# EAGLE board Full (EAGLE 9.6.2), part 1 of 3
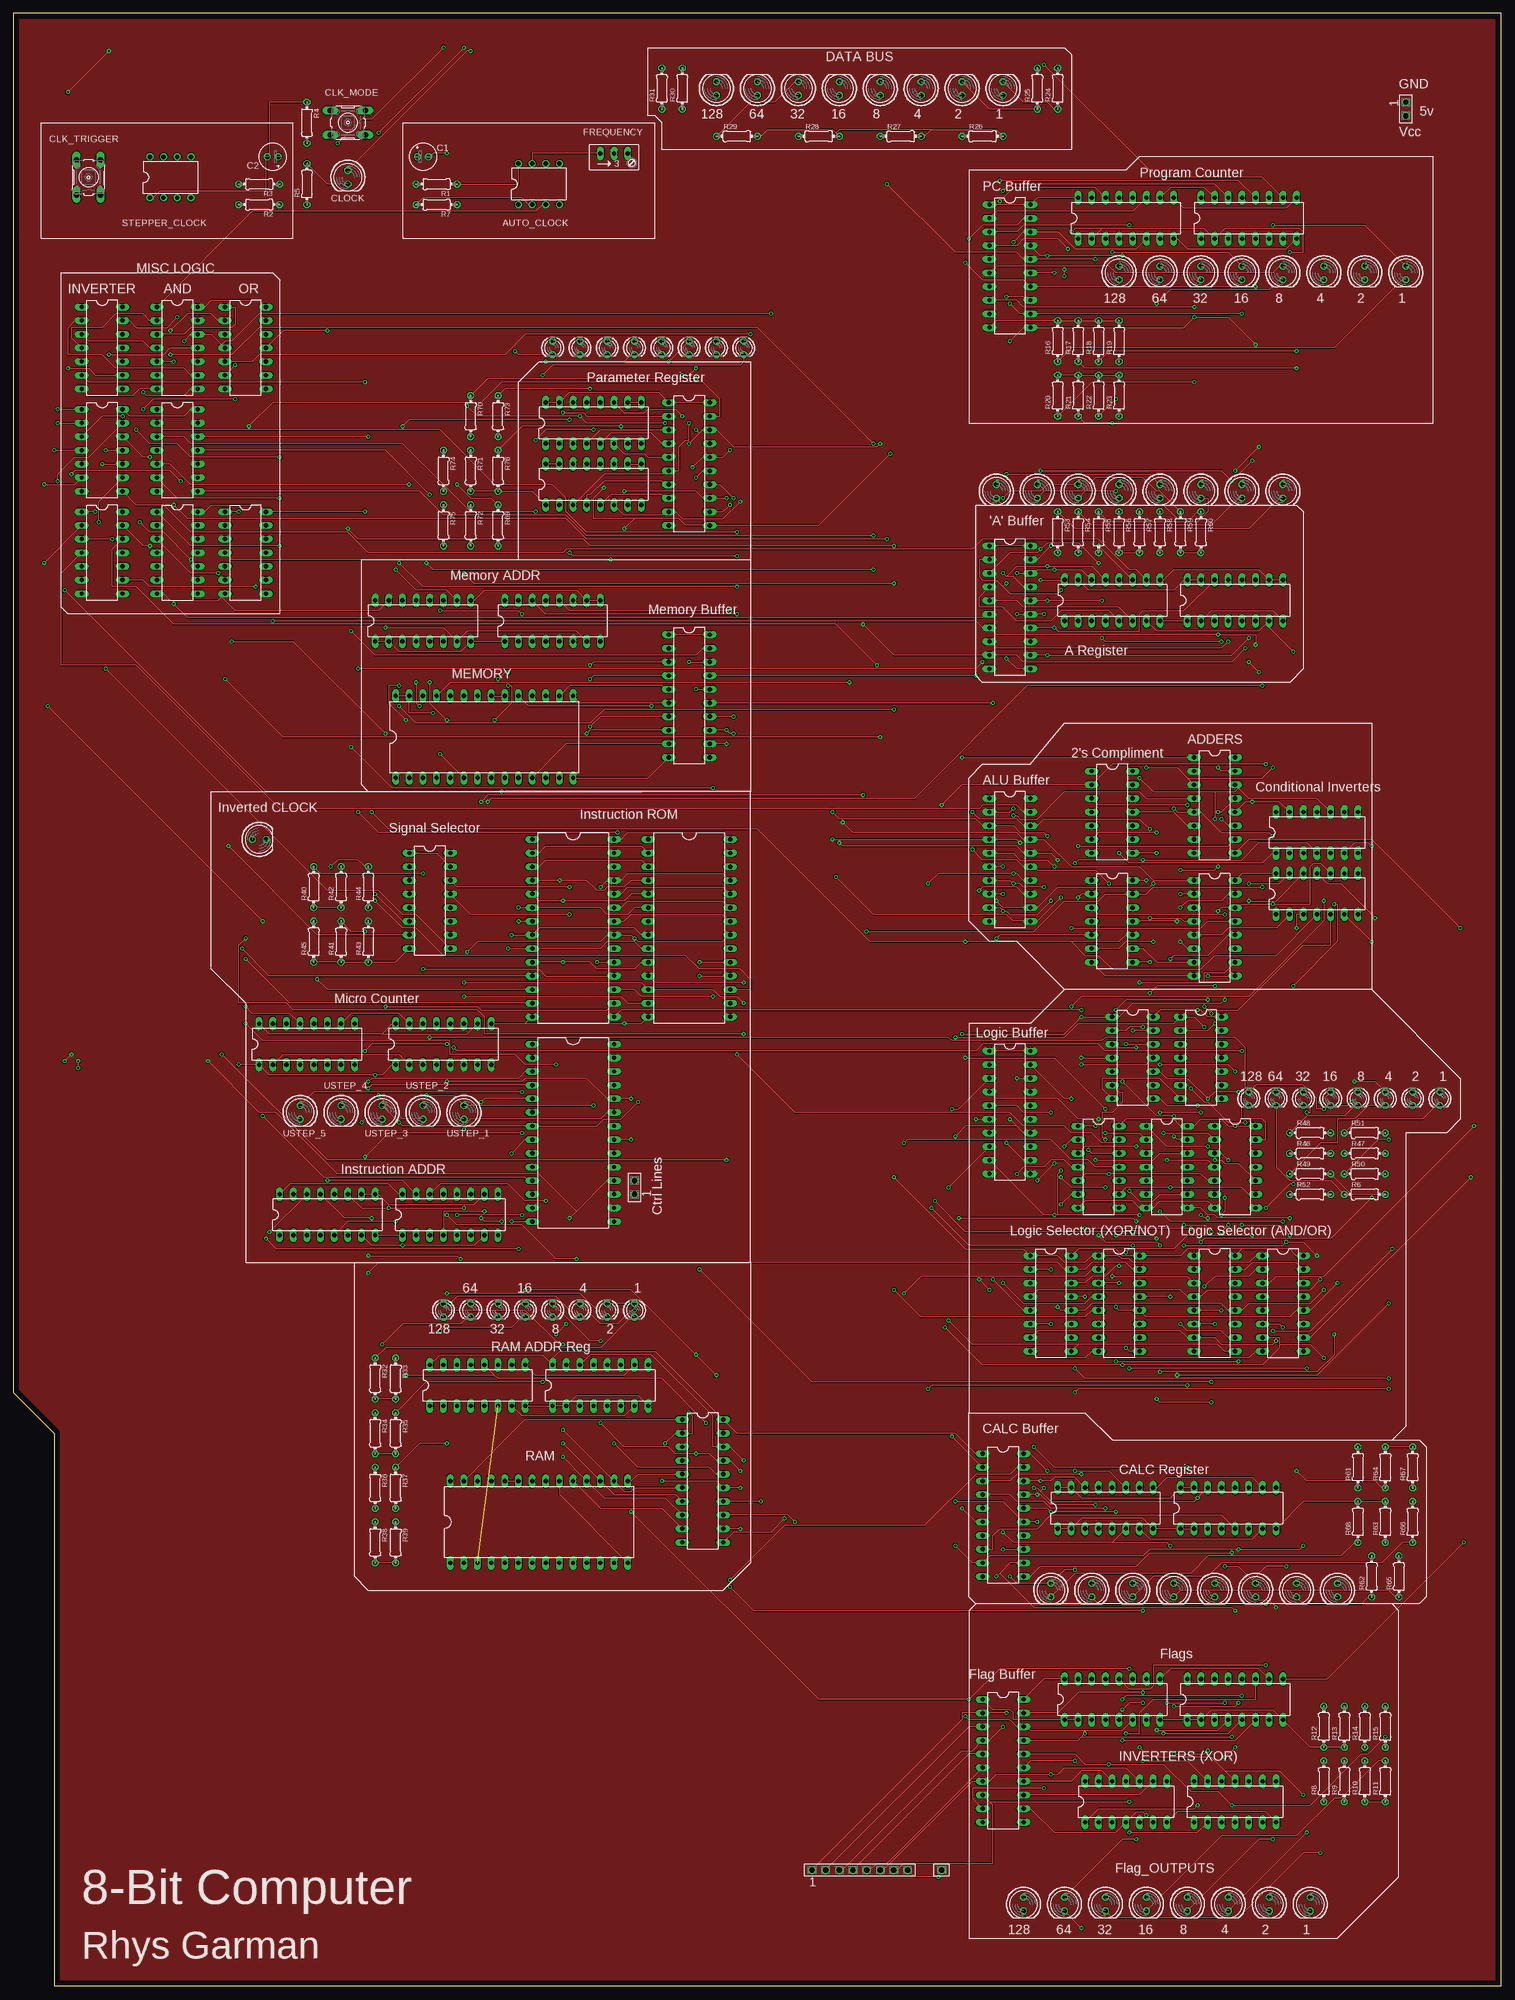
[diagram p5: board, top side]
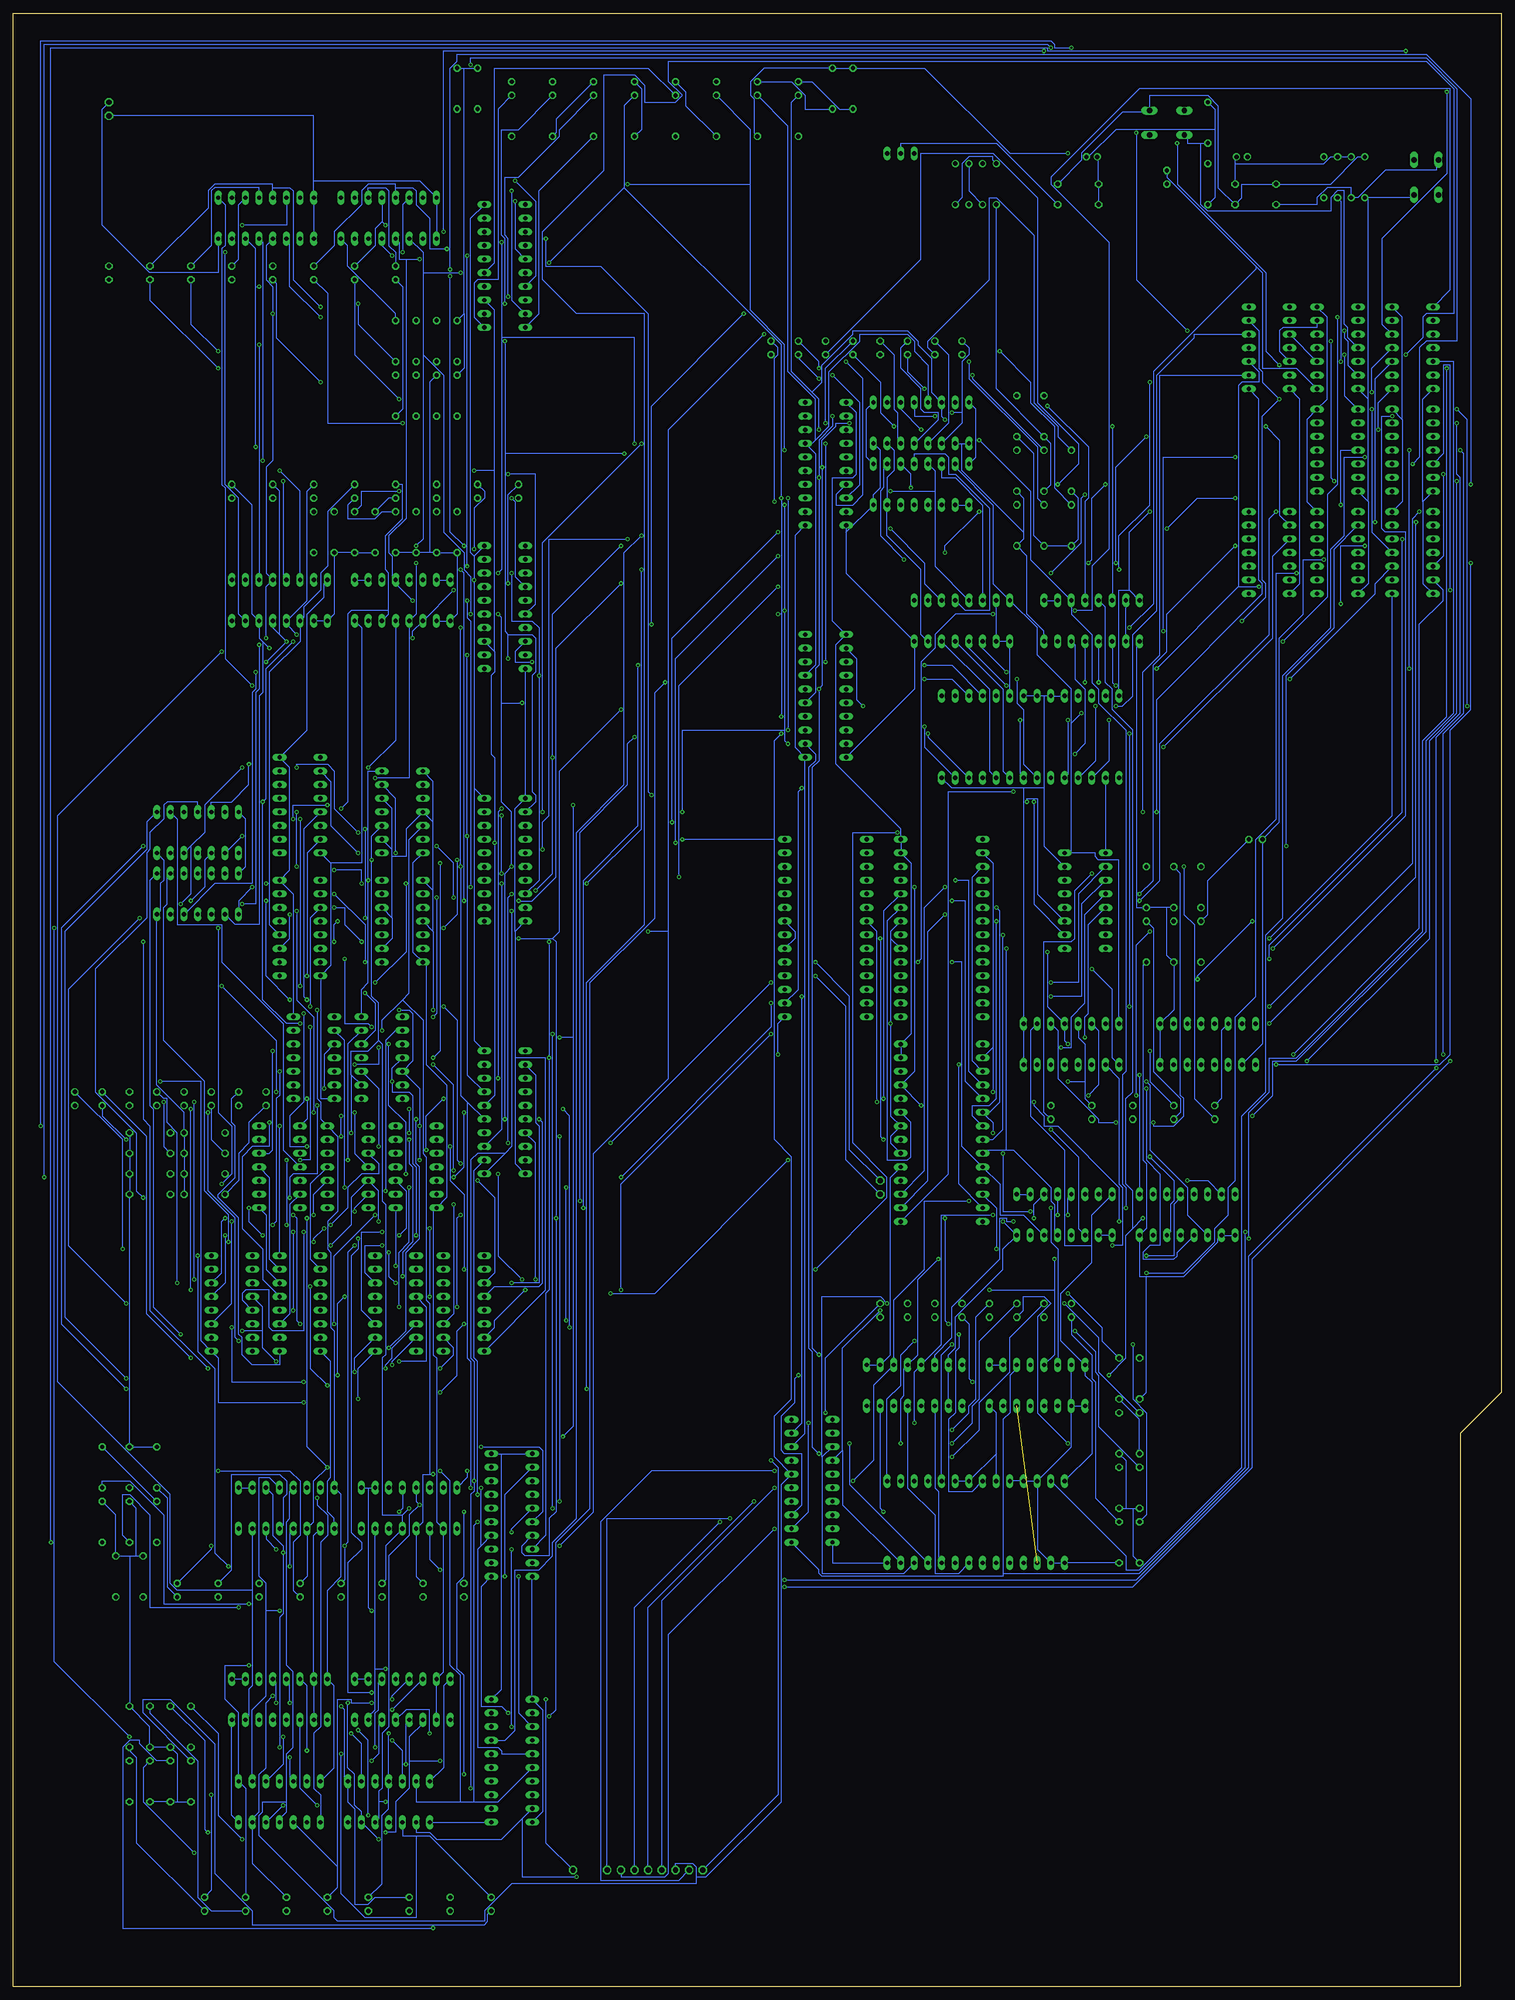
[diagram p6: board, bottom side, seen from below]

Size 276.86 x 367.03 mm. Coordinates in mm from the lower left corner, seen from the top.
Outline: 276.86,367.03 0,367.03 0,110.49 7.62,102.87 7.62,0 276.86,0 276.86,367.03
Copper layers (1*16): Top 0.035mm / dielectric 1.5mm / Bottom 0.035mm
Design rules "default": minimum track width 6mil, minimum drill 0.35mm, track to track 6mil, track to pad 6mil, pad to pad 6mil, via to via 6mil, smd to smd 6mil, copper to edge 40mil, drill to drill 6mil, minimum pad ring 10mil, minimum via ring 8mil, stop-mask expansion 4mil, vias tented up to drill 0mil, thermal gap 10mil

## Footprints (pad centres in the part's own frame; a part is rotated, then mirrored left to right if it is on the bottom)
DIL16 = drill 0.813 long: 1 -8.89,-3.81; 2 -6.35,-3.81; 3 -3.81,-3.81; 4 -1.27,-3.81; 5 1.27,-3.81; 6 3.81,-3.81; 7 6.35,-3.81; 8 8.89,-3.81; 9 8.89,3.81; 10 6.35,3.81; 11 3.81,3.81; 12 1.27,3.81; 13 -1.27,3.81; 14 -3.81,3.81; 15 -6.35,3.81; 16 -8.89,3.81
SSW-102-02-G-S = drill 1 pad 1.5 octagon: 1 -1.27,0; 2 1.27,0
DIL14 = drill 0.813 long: 1 -7.62,-3.81; 2 -5.08,-3.81; 3 -2.54,-3.81; 4 0,-3.81; 5 2.54,-3.81; 6 5.08,-3.81; 7 7.62,-3.81; 8 7.62,3.81; 9 5.08,3.81; 10 2.54,3.81; 11 0,3.81; 12 -2.54,3.81; 13 -5.08,3.81; 14 -7.62,3.81
DIL08 = drill 0.813 pad 1.27: 1 -3.81,-3.81; 2 -1.27,-3.81; 3 1.27,-3.81; 4 3.81,-3.81; 5 3.81,3.81; 6 1.27,3.81; 7 -1.27,3.81; 8 -3.81,3.81
E2-5 = drill 0.813 pad 1.27: + -1.016,0 | drill 0.813 pad 1.27 octagon: - 1.016,0
SSW-101-02-G-S = drill 1 pad 1.5 octagon: 1 0,0
B3F-10XX = drill 1.016 long: 1 -3.251,2.261; 2 3.251,2.261; 3 -3.251,-2.261; 4 3.251,-2.261
LED5MM = drill 0.813 octagon: A -1.27,0; K 1.27,0
SSW-108-02-G-S = drill 1 pad 1.5 octagon: 1 -8.89,0; 2 -6.35,0; 3 -3.81,0; 4 -1.27,0; 5 1.27,0; 6 3.81,0; 7 6.35,0; 8 8.89,0
RJ9W = drill 0.813 long: A 2.54,0.635; E -2.54,0.635; S 0,0.635
DIL28-6 = drill 0.813 long: 1 -16.51,-7.62; 2 -13.97,-7.62; 3 -11.43,-7.62; 4 -8.89,-7.62; 5 -6.35,-7.62; 6 -3.81,-7.62; 7 -1.27,-7.62; 8 1.27,-7.62; 9 3.81,-7.62; 10 6.35,-7.62; 11 8.89,-7.62; 12 11.43,-7.62; 13 13.97,-7.62; 14 16.51,-7.62; 15 16.51,7.62; 16 13.97,7.62; 17 11.43,7.62; 18 8.89,7.62; 19 6.35,7.62; 20 3.81,7.62; 21 1.27,7.62; 22 -1.27,7.62; 23 -3.81,7.62; 24 -6.35,7.62; 25 -8.89,7.62; 26 -11.43,7.62; 27 -13.97,7.62; 28 -16.51,7.62
LED3MM = drill 0.813 octagon: A -1.27,0; K 1.27,0
DIL20 = drill 0.813 long: 1 -11.43,-3.81; 2 -8.89,-3.81; 3 -6.35,-3.81; 4 -3.81,-3.81; 5 -1.27,-3.81; 6 1.27,-3.81; 7 3.81,-3.81; 8 6.35,-3.81; 9 8.89,-3.81; 10 11.43,-3.81; 11 11.43,3.81; 12 8.89,3.81; 13 6.35,3.81; 14 3.81,3.81; 15 1.27,3.81; 16 -1.27,3.81; 17 -3.81,3.81; 18 -6.35,3.81; 19 -8.89,3.81; 20 -11.43,3.81
0204/7 = drill 0.813 octagon: 1 -3.81,0; 2 3.81,0

## Placement (x,y rotation side)
ADDER_LOWER  74LS283N  [DIL16]  223.52,196.85 270 top
ADDER_UPPER  74LS283N  [DIL16]  223.52,219.71 270 top
ADDITIONAL_CONTROL_LINES  SSW-102-02-G-S  [SSW-102-02-G-S]  115.57,148.59 90 top
ADDR_MEM_REG_LOWER  74LS173N  [DIL16]  100.33,254 0 top
ADDR_MEM_REG_UPPER  74LS173N  [DIL16]  76.2,254 0 top
ADDR_REG_A_LOWER  74LS173N  [DIL16]  227.33,257.81 0 top
ADDR_REG_A_UPPER  74LS173N  [DIL16]  204.47,257.81 0 top
ADDR_REG_CALC_LOWER  74LS173N  [DIL16]  226.06,88.9 0 top
ADDR_REG_CALC_LOWER1  74LS173N  [DIL16]  107.95,279.4 0 top
ADDR_REG_CALC_UPPER  74LS173N  [DIL16]  203.2,88.9 0 top
ADDR_REG_PARAM_UPPER  74LS173N  [DIL16]  107.95,290.83 0 top
AND_GATE1  74LS30N  [DIL14]  30.48,285.75 270 top
AND_GATE1_  74LS08N  [DIL14]  214.63,152.4 270 top
AND_GATE2_  74LS08N  [DIL14]  227.33,152.4 270 top
AND_GATE3_  74LS08N  [DIL14]  30.48,266.7 270 top
AND_GATE_  74LS08N  [DIL14]  30.48,304.8 270 top
AUTO_CLOCK  NE555N  [DIL08]  97.79,335.28 0 top
C1  4.7uF  [E2-5]  76.2,340.36 0 top
C2  0.1uF  [E2-5]  48.26,340.36 180 top
CLK_EXTENSION  SSW-101-02-G-S  [SSW-101-02-G-S]  172.72,21.59 0 top
CLK_MODE  [B3F-10XX]  62.23,346.71 180 top
CLK_TRIGGER  [B3F-10XX]  13.97,336.55 90 top
CLOCK  [LED5MM]  62.23,336.55 270 top
DATA_BUS_EXTENSION  SSW-108-02-G-S  [SSW-108-02-G-S]  157.48,21.59 0 top
DATABUS_1  [LED5MM]  184.15,353.06 90 top
DATABUS_2  [LED5MM]  176.53,353.06 90 top
DATABUS_3  [LED5MM]  168.91,353.06 90 top
DATABUS_4  [LED5MM]  161.29,353.06 90 top
DATABUS_5  [LED5MM]  153.67,353.06 90 top
DATABUS_6  [LED5MM]  146.05,353.06 90 top
DATABUS_7  [LED5MM]  138.43,353.06 90 top
DATABUS_8  [LED5MM]  130.81,353.06 90 top
FLAG_1  [LED5MM]  241.3,15.24 270 top
FLAG_2  [LED5MM]  233.68,15.24 270 top
FLAG_3  [LED5MM]  226.06,15.24 270 top
FLAG_4  [LED5MM]  218.44,15.24 270 top
FLAG_5  [LED5MM]  210.82,15.24 270 top
FLAG_6  [LED5MM]  203.2,15.24 270 top
FLAG_7  [LED5MM]  195.58,15.24 270 top
FLAG_8  [LED5MM]  187.96,15.24 270 top
FLAG_REG_LOWER  74LS173N  [DIL16]  227.33,53.34 0 top
FLAG_REG_UPPER  74LS173N  [DIL16]  204.47,53.34 0 top
FREQUENCY  100k  [RJ9W]  111.76,340.36 0 top
INSTRUC_REGISTER_LOWER  74LS173N  [DIL16]  81.28,143.51 0 top
INSTRUC_REGISTER_UPPER  74LS173N  [DIL16]  58.42,143.51 0 top
INSTRUCTION_MEMORY_LOWER  AT28C64B  [DIL28-6]  104.14,158.75 270 top
INSTRUCTION_MEMORY_UPPER  AT28C64B  [DIL28-6]  104.14,196.85 270 top
INSTRUCTION_MEMORY_UPPER2  AT28C64B  [DIL28-6]  125.73,196.85 270 top
INVERTED_CLK_LED  [LED5MM]  45.72,213.36 0 top
LED_A_REG_1  [LED5MM]  236.22,278.13 270 top
LED_A_REG_2  [LED5MM]  228.6,278.13 270 top
LED_A_REG_3  [LED5MM]  220.98,278.13 270 top
LED_A_REG_4  [LED5MM]  213.36,278.13 270 top
LED_A_REG_5  [LED5MM]  205.74,278.13 270 top
LED_A_REG_6  [LED5MM]  198.12,278.13 270 top
LED_A_REG_7  [LED5MM]  190.5,278.13 270 top
LED_A_REG_8  [LED5MM]  182.88,278.13 270 top
LED_B_REG_1  [LED5MM]  246.38,73.66 270 top
LED_B_REG_2  [LED5MM]  238.76,73.66 270 top
LED_B_REG_3  [LED5MM]  231.14,73.66 270 top
LED_B_REG_4  [LED5MM]  223.52,73.66 270 top
LED_B_REG_5  [LED5MM]  215.9,73.66 270 top
LED_B_REG_6  [LED5MM]  208.28,73.66 270 top
LED_B_REG_7  [LED5MM]  200.66,73.66 270 top
LED_B_REG_8  [LED5MM]  193.04,73.66 270 top
LOGIC_LED_1  [LED3MM]  265.43,165.1 270 top
LOGIC_LED_2  [LED3MM]  260.35,165.1 270 top
LOGIC_LED_3  [LED3MM]  255.27,165.1 270 top
LOGIC_LED_4  [LED3MM]  250.19,165.1 270 top
LOGIC_LED_5  [LED3MM]  245.11,165.1 270 top
LOGIC_LED_6  [LED3MM]  240.03,165.1 270 top
LOGIC_LED_7  [LED3MM]  234.95,165.1 270 top
LOGIC_LED_8  [LED3MM]  229.87,165.1 270 top
LOGIC_SELECTOR-AND/OR_LOWER  74LS157N  [DIL16]  236.22,127 270 top
LOGIC_SELECTOR-AND/OR_UPPER  74LS157N  [DIL16]  223.52,127 270 top
LOGIC_SELECTOR-XOR/NOT_LOWER  74LS157N  [DIL16]  205.74,127 270 top
LOGIC_SELECTOR-XOR/NOT_UPPER  74LS157N  [DIL16]  193.04,127 270 top
MEMORY  AT28C64B  [DIL28-6]  87.63,232.41 0 top
MICRO_COUNTER_LOWER  74LS161  [DIL16]  80.01,175.26 0 top
MICRO_COUNTER_UPPER  74LS161  [DIL16]  54.61,175.26 0 top
NOT_GATE  74LS04N  [DIL14]  201.93,152.4 270 top
NOT_GATE1  74LS04N  [DIL14]  16.51,304.8 270 top
NOT_GATE2_  74LS04N  [DIL14]  16.51,285.75 270 top
NOT_GATE2_1  74LS04N  [DIL14]  43.18,266.7 270 top
NOT_GATE3_  74LS04N  [DIL14]  16.51,266.7 270 top
OR_GATE  74LS32N  [DIL14]  208.28,172.72 270 top
OR_GATE1  74LS32N  [DIL14]  43.18,304.8 270 top
OR_GATE_2  74LS32N  [DIL14]  220.98,172.72 270 top
OUTPUT_BUFFER_ALU  74LS245N  [DIL20]  185.42,209.55 270 top
OUTPUT_BUFFER_CALC_REG  74LS245N  [DIL20]  184.15,87.63 270 top
OUTPUT_BUFFER_FLAGS  74HC245N  [DIL20]  184.15,41.91 270 top
OUTPUT_BUFFER_LOGIC  74LS245N  [DIL20]  185.42,162.56 270 top
OUTPUT_BUFFER_MEMORY  74LS245N  [DIL20]  125.73,240.03 270 top
OUTPUT_BUFFER_PARAM_REG  74LS245N  [DIL20]  125.73,283.21 270 top
OUTPUT_BUFFER_PC  74LS245N  [DIL20]  185.42,320.04 270 top
OUTPUT_BUFFER_RAM  74HC245N  [DIL20]  128.27,93.98 270 top
OUTPUT_BUFFER_REG_A  74LS245N  [DIL20]  185.42,256.54 270 top
PARAM_LED_1  [LED3MM]  135.89,304.8 270 top
PARAM_LED_2  [LED3MM]  130.81,304.8 270 top
PARAM_LED_3  [LED3MM]  125.73,304.8 270 top
PARAM_LED_4  [LED3MM]  120.65,304.8 270 top
PARAM_LED_5  [LED3MM]  115.57,304.8 270 top
PARAM_LED_6  [LED3MM]  110.49,304.8 270 top
PARAM_LED_7  [LED3MM]  105.41,304.8 270 top
PARAM_LED_8  [LED3MM]  100.33,304.8 270 top
PC_1  [LED5MM]  259.08,318.77 270 top
PC_2  [LED5MM]  251.46,318.77 270 top
PC_3  [LED5MM]  243.84,318.77 270 top
PC_4  [LED5MM]  236.22,318.77 270 top
PC_5  [LED5MM]  228.6,318.77 270 top
PC_6  [LED5MM]  220.98,318.77 270 top
PC_7  [LED5MM]  213.36,318.77 270 top
PC_8  [LED5MM]  205.74,318.77 270 top
POWER  SSW-102-02-G-S  [SSW-102-02-G-S]  259.08,349.25 270 top
PROGRAM_COUNTER_LOWER  74LS161  [DIL16]  229.87,328.93 0 top
PROGRAM_COUNTER_UPPER  74LS161  [DIL16]  207.01,328.93 0 top
R1  1k  [0204/7]  78.74,335.28 180 top
R2  1k  [0204/7]  45.72,331.47 180 top
R3  10k  [0204/7]  45.72,335.28 180 top
R4  220  [0204/7]  54.61,346.71 270 top
R5  ~220  [0204/7]  54.61,335.28 90 top
R6  ~220  [0204/7]  251.46,147.32 0 top
R7  220  [0204/7]  78.74,331.47 180 top
R8  ~220  [0204/7]  243.84,38.1 90 top
R9  ~220  [0204/7]  247.65,38.1 90 top
R10  ~220  [0204/7]  251.46,38.1 90 top
R11  ~220  [0204/7]  255.27,38.1 90 top
R12  ~220  [0204/7]  243.84,48.26 90 top
R13  ~220  [0204/7]  247.65,48.26 90 top
R14  ~220  [0204/7]  251.46,48.26 90 top
R15  ~220  [0204/7]  255.27,48.26 90 top
R16  ~220  [0204/7]  194.31,306.07 90 top
R17  ~220  [0204/7]  198.12,306.07 90 top
R18  ~220  [0204/7]  201.93,306.07 90 top
R19  ~220  [0204/7]  205.74,306.07 90 top
R20  ~220  [0204/7]  194.31,295.91 90 top
R21  ~220  [0204/7]  198.12,295.91 90 top
R22  ~220  [0204/7]  201.93,295.91 90 top
R23  ~220  [0204/7]  205.74,295.91 90 top
R24  ~220  [0204/7]  194.31,353.06 90 top
R25  ~220  [0204/7]  190.5,353.06 90 top
R26  ~220  [0204/7]  180.34,344.17 0 top
R27  ~220  [0204/7]  165.1,344.17 0 top
R28  ~220  [0204/7]  149.86,344.17 0 top
R29  ~220  [0204/7]  134.62,344.17 0 top
R30  ~220  [0204/7]  124.46,353.06 90 top
R31  ~220  [0204/7]  120.65,353.06 90 top
R32  ~220  [0204/7]  67.31,113.03 270 top
R33  ~220  [0204/7]  71.12,113.03 270 top
R34  ~220  [0204/7]  67.31,102.87 270 top
R35  ~220  [0204/7]  71.12,102.87 270 top
R36  ~220  [0204/7]  67.31,92.71 270 top
R37  ~220  [0204/7]  71.12,92.71 270 top
R38  ~220  [0204/7]  67.31,82.55 270 top
R39  ~220  [0204/7]  71.12,82.55 270 top
R40  ~220  [0204/7]  55.88,204.47 90 top
R41  ~220  [0204/7]  60.96,194.31 90 top
R42  ~220  [0204/7]  60.96,204.47 90 top
R43  ~220  [0204/7]  66.04,194.31 90 top
R44  ~220  [0204/7]  66.04,204.47 90 top
R45  ~220  [0204/7]  55.88,194.31 90 top
R46  ~220  [0204/7]  241.3,154.94 0 top
R47  ~220  [0204/7]  251.46,154.94 0 top
R48  ~220  [0204/7]  241.3,158.75 0 top
R49  ~220  [0204/7]  241.3,151.13 0 top
R50  ~220  [0204/7]  251.46,151.13 0 top
R51  ~220  [0204/7]  251.46,158.75 0 top
R52  ~220  [0204/7]  241.3,147.32 0 top
R53  ~220  [0204/7]  194.31,270.51 270 top
R54  ~220  [0204/7]  198.12,270.51 270 top
R55  ~220  [0204/7]  201.93,270.51 270 top
R56  ~220  [0204/7]  205.74,270.51 270 top
R57  ~220  [0204/7]  209.55,270.51 270 top
R58  ~220  [0204/7]  213.36,270.51 270 top
R59  ~220  [0204/7]  217.17,270.51 270 top
R60  ~220  [0204/7]  220.98,270.51 270 top
R61  ~220  [0204/7]  250.19,96.52 90 top
R62  ~220  [0204/7]  252.73,76.2 90 top
R63  ~220  [0204/7]  255.27,86.36 90 top
R64  ~220  [0204/7]  255.27,96.52 90 top
R65  ~220  [0204/7]  257.81,76.2 90 top
R66  ~220  [0204/7]  260.35,86.36 90 top
R67  ~220  [0204/7]  260.35,96.52 90 top
R68  ~220  [0204/7]  250.19,86.36 90 top
R69  ~220  [0204/7]  90.17,271.78 270 top
R70  ~220  [0204/7]  85.09,292.1 270 top
R71  ~220  [0204/7]  85.09,281.94 270 top
R72  ~220  [0204/7]  85.09,271.78 270 top
R73  ~220  [0204/7]  90.17,292.1 270 top
R74  ~220  [0204/7]  80.01,281.94 270 top
R75  ~220  [0204/7]  80.01,271.78 270 top
R76  ~220  [0204/7]  90.17,281.94 270 top
RAM  71256SA15TPG  [DIL28-6]  97.79,86.36 0 top
RAM_ADDR_LOWER  74LS173N  [DIL16]  109.22,111.76 0 top
RAM_ADDR_UPPER  74LS173N  [DIL16]  86.36,111.76 0 top
RAM_LED_1  [LED3MM]  115.57,125.73 270 top
RAM_LED_2  [LED3MM]  110.49,125.73 270 top
RAM_LED_3  [LED3MM]  105.41,125.73 270 top
RAM_LED_4  [LED3MM]  100.33,125.73 270 top
RAM_LED_5  [LED3MM]  95.25,125.73 270 top
RAM_LED_6  [LED3MM]  90.17,125.73 270 top
RAM_LED_7  [LED3MM]  85.09,125.73 270 top
RAM_LED_8  [LED3MM]  80.01,125.73 270 top
SELECTOR_  74HC139N  [DIL16]  77.47,201.93 270 top
STEPPER_CLOCK  NE555N  [DIL08]  29.21,336.55 0 top
SUBTRACT_INVRTR_LOWER_  74LS86N  [DIL14]  204.47,198.12 270 top
SUBTRACT_INVRTR_LOWER_1  74LS86N  [DIL14]  242.57,214.63 0 top
SUBTRACT_INVRTR_UPPER_  74LS86N  [DIL14]  204.47,218.44 270 top
SUBTRACT_INVRTR_UPPER_1  74LS86N  [DIL14]  242.57,203.2 0 top
USTEP_1  [LED5MM]  83.82,162.56 270 top
USTEP_2  [LED5MM]  76.2,162.56 270 top
USTEP_3  [LED5MM]  68.58,162.56 270 top
USTEP_4  [LED5MM]  60.96,162.56 270 top
USTEP_5  [LED5MM]  53.34,162.56 270 top
XOR_GATE2_  74LS86N  [DIL14]  227.33,34.29 0 top
XOR_GATE_  74LS86N  [DIL14]  207.01,34.29 0 top

## Tracks (layer width: path | path; a pad name or v marks a point on that pad's centre or on a via)
1_PLACE  (via drill 0.35)
  Top 0.152: v184.79,247.01 186.69,245.11 OUTPUT_BUFFER_REG_A.11 | v186.69,168.91 OUTPUT_BUFFER_LOGIC.18 | v186.06,219.07 185.42,218.44 OUTPUT_BUFFER_ALU.2 | v231.14,305.44 226.06,310.51 v219.71,310.51 217.81,308.61 OUTPUT_BUFFER_PC.11 187.96,308.61 v185.42,306.07 | v227.33,44.45 v225.43,42.54 | v184.79,50.8 OUTPUT_BUFFER_FLAGS.2 176.53,50.8 176.53,49.53 DATA_BUS_EXTENSION.1 | v226.69,80.64 211.46,80.64 208.91,78.1 191.13,78.1 189.23,76.2 OUTPUT_BUFFER_CALC_REG.11 | 115.57,273.05 v113.67,271.14 | 115.57,273.05 123.83,273.05 125.09,271.78 OUTPUT_BUFFER_PARAM_REG.11 149.86,271.78 v163.19,285.12 | v109.86,278.76 107.95,276.86 107.95,273.05 115.57,273.05 | RAM_ADDR_LOWER.14 107.31,117.47 118.75,117.47 130.18,106.04 130.18,100.33 OUTPUT_BUFFER_RAM.18 133.35,100.33 v135.89,97.79 | v87,142.88 87.63,142.24 v90.81,142.24
  Bottom 0.152: OUTPUT_BUFFER_ALU.2 179.7,220.34 179.7,221.61 180.34,222.25 180.34,243.84 179.7,244.47 179.7,250.82 180.34,251.46 184.79,251.46 | v184.79,247.01 184.79,251.46 | v186.69,168.91 186.69,218.44 v186.06,219.07 | OUTPUT_BUFFER_PC.11 191.13,310.51 191.13,316.87 190.5,317.5 186.69,317.5 186.69,349.25 DATABUS_1.A | PROGRAM_COUNTER_LOWER.3 225.43,324.49 225.43,316.23 v219.71,310.51 | v231.14,305.44 ADDR_REG_A_LOWER.11 | 184.79,251.46 185.42,252.09 185.42,285.12 | v185.42,306.07 185.42,285.12 | XOR_GATE2_.12 225.43,38.73 v225.43,42.54 | v227.33,44.45 227.33,68.58 226.69,69.22 v226.69,80.64 226.69,81.91 228.6,83.82 228.6,91.44 ADDR_REG_CALC_LOWER.11 | v184.79,50.8 186.06,52.07 189.87,52.07 189.87,74.29 OUTPUT_BUFFER_CALC_REG.11 | OUTPUT_BUFFER_PARAM_REG.11 131.44,269.88 131.44,230.5 OUTPUT_BUFFER_MEMORY.11 129.54,102.87 OUTPUT_BUFFER_RAM.18 | ADDR_MEM_REG_LOWER.11 107.31,260.99 107.31,264.8 v113.67,271.14 | ADDR_REG_CALC_LOWER1.11 109.86,281.31 v109.86,278.76 | INSTRUC_REGISTER_LOWER.11 87,145.41 v87,142.88 | v90.81,142.24 92.08,142.24 92.08,142.88 93.34,142.88 93.34,135.25 102.23,126.36 102.23,120.65 105.41,117.47 RAM_ADDR_LOWER.14 | DATA_BUS_EXTENSION.1 134.62,35.56 134.62,96.52 v135.89,97.79 | v163.19,285.12 185.42,285.12
2_PLACE  (via drill 0.35)
  Top 0.152: 183.51,76.83 185.42,78.74 OUTPUT_BUFFER_CALC_REG.12 | 183.51,76.83 v182.88,76.2 | DATA_BUS_EXTENSION.2 177.8,48.26 OUTPUT_BUFFER_FLAGS.3 | v227.33,69.85 226.69,70.48 189.87,70.48 183.51,76.83 | v185.42,313.06 187.32,311.15 OUTPUT_BUFFER_PC.12 v228.6,311.15 | v109.22,104.77 113.67,100.33 121.92,100.33 123.19,99.06 v127,99.06 129.54,99.06 130.81,97.79 OUTPUT_BUFFER_RAM.17 133.35,97.79 v135.25,95.88 | v94.62,143.51 v82.55,143.51 | v132.72,231.14 OUTPUT_BUFFER_MEMORY.12 | v133.35,275.59 132.08,274.32 OUTPUT_BUFFER_PARAM_REG.12 | ADDR_MEM_REG_LOWER.12 103.5,255.91 v133.35,255.91 | v192.41,214 191.77,214.63 187.32,214.63 186.06,215.9 OUTPUT_BUFFER_ALU.3 180.34,215.9 179.07,217.17 153.67,217.17 v152.4,218.44 | OUTPUT_BUFFER_REG_A.12 v192.41,247.65 226.69,247.65 v229.87,250.82
  Bottom 0.152: ADDR_REG_CALC_LOWER.12 229.24,94.61 231.14,94.61 231.14,76.2 229.87,74.93 229.87,69.85 | 229.87,69.85 229.87,53.97 232.41,51.44 XOR_GATE2_.9 | OUTPUT_BUFFER_FLAGS.3 182.88,50.8 v182.88,76.2 | v227.33,69.85 229.87,69.85 | DATABUS_2.A 182.88,345.44 186.06,345.44 186.06,325.75 185.42,325.12 v185.42,313.06 | PROGRAM_COUNTER_LOWER.4 229.87,323.85 229.87,317.5 228.6,316.23 v228.6,311.15 228.6,283.84 229.87,282.57 229.87,262.89 ADDR_REG_A_LOWER.12 229.87,260.35 v229.87,250.82 | v109.22,104.77 109.22,114.3 RAM_ADDR_LOWER.13 104.14,119.38 104.14,143.51 v94.62,143.51 | v82.55,143.51 INSTRUC_REGISTER_LOWER.12 | ADDR_MEM_REG_LOWER.12 99.7,255.91 95.25,255.91 95.25,274.95 101.6,281.31 102.87,281.31 102.87,284.48 103.5,285.12 109.22,285.12 ADDR_REG_CALC_LOWER1.12 | v132.72,231.14 133.35,231.78 133.35,233.68 | v133.35,275.59 v133.35,255.91 133.35,233.68 | OUTPUT_BUFFER_LOGIC.17 192.41,169.54 v192.41,214 v192.41,247.65 | 133.35,233.68 152.4,233.68 v152.4,218.44 | v127,99.06 128.27,100.33 128.27,118.11 128.91,118.74 128.91,226.69 127.64,227.97 127.64,229.23 OUTPUT_BUFFER_MEMORY.12 | DATA_BUS_EXTENSION.2 153.04,19.69 167.64,19.69 167.64,86.36 158.12,95.88 v135.25,95.88
4_PLACE  (via drill 0.35)
  Top 0.152: v230.5,283.84 v226.69,280.03 224.79,281.94 v191.13,281.94 | v187.32,212.72 186.69,213.36 OUTPUT_BUFFER_ALU.4 v152.4,213.36 | v184.79,314.32 187.96,314.32 188.59,313.69 OUTPUT_BUFFER_PC.13 | OUTPUT_BUFFER_MEMORY.13 v132.72,233.68 133.35,233.04 v133.99,233.04 | v132.72,276.86 OUTPUT_BUFFER_PARAM_REG.13 128.27,276.86 127,278.13 v113.67,278.13 | DATA_BUS_EXTENSION.3 154.31,21.59 176.53,43.81 178.44,43.81 OUTPUT_BUFFER_FLAGS.4 181.61,45.72 v184.15,48.26 | v184.15,81.28 OUTPUT_BUFFER_CALC_REG.13 | v111.76,100.96 116.21,96.52 129.54,96.52 130.81,95.25 OUTPUT_BUFFER_RAM.16 | v80.65,143.51 82.55,141.6 94.62,141.6 100.97,135.25 v104.78,135.25
  Bottom 0.152: ADDR_REG_A_LOWER.13 226.69,262.25 v226.69,280.03 | v230.5,283.84 230.5,324.49 PROGRAM_COUNTER_LOWER.5 | OUTPUT_BUFFER_LOGIC.16 187.32,165.73 v187.32,212.72 187.32,228.6 187.96,229.23 187.96,243.84 187.32,244.47 187.32,248.28 | OUTPUT_BUFFER_REG_A.13 187.32,248.28 | OUTPUT_BUFFER_PC.13 187.32,311.78 187.32,281.94 | 187.32,248.28 187.32,281.94 | DATABUS_3.A 175.26,345.44 175.26,344.17 182.88,336.55 185.42,336.55 185.42,325.75 184.79,325.12 v184.79,314.32 | 187.32,281.94 v191.13,281.94 | ADDR_MEM_REG_LOWER.13 105.41,264.16 105.41,278.13 | 105.41,278.13 105.41,281.94 ADDR_REG_CALC_LOWER1.13 | v132.72,276.86 v132.72,233.68 | v113.67,278.13 105.41,278.13 | ADDR_REG_CALC_LOWER.13 225.43,92.07 225.43,87 226.06,86.36 226.06,59.69 224.79,58.42 224.79,44.45 226.06,43.18 226.06,34.29 | 226.06,34.29 226.06,32.38 227.33,31.11 XOR_GATE2_.4 | 149.86,20.32 147.95,20.32 133.99,34.29 133.99,93.34 OUTPUT_BUFFER_RAM.16 135.25,98.42 135.25,106.04 132.08,109.22 132.08,154.31 135.25,157.48 135.25,213.36 | 149.86,20.32 149.86,22.22 150.5,22.86 153.67,22.86 DATA_BUS_EXTENSION.3 | v184.15,48.26 v184.15,81.28 | v111.76,100.96 111.76,109.22 111.12,109.85 111.12,114.93 RAM_ADDR_LOWER.12 108.59,117.47 108.59,131.44 v104.78,135.25 | INSTRUC_REGISTER_LOWER.13 80.65,146.69 v80.65,143.51 | 226.06,34.29 230.5,34.29 230.5,32.38 231.14,31.75 231.14,27.94 217.17,13.97 217.17,12.7 216.53,12.06 189.23,12.06 189.23,13.97 184.15,19.05 149.86,19.05 149.86,20.32 | v133.99,233.04 135.25,231.78 135.25,213.36 | 135.25,213.36 v152.4,213.36
8_PLACE  (via drill 0.35)
  Top 0.152: v120.65,93.98 130.81,93.98 OUTPUT_BUFFER_RAM.15 v135.25,92.71 | INSTRUC_REGISTER_LOWER.14 79.38,149.22 92.08,149.22 95.25,146.05 v99.06,146.05 | ADDR_REG_CALC_LOWER.14 v220.34,90.8 219.71,90.17 193.04,90.17 191.13,92.07 | DATA_BUS_EXTENSION.4 177.8,43.18 OUTPUT_BUFFER_FLAGS.5 | 191.13,92.07 190.5,92.71 v189.87,92.71 | v177.17,320.68 180.34,317.5 187.96,317.5 OUTPUT_BUFFER_PC.14 v231.14,316.23 | v133.99,236.22 OUTPUT_BUFFER_MEMORY.14 | v133.99,276.86 131.44,279.4 OUTPUT_BUFFER_PARAM_REG.14 | ADDR_MEM_REG_LOWER.14 99.06,255.27 v134.62,255.27 | v193.68,208.28 192.41,209.55 187.32,209.55 186.06,210.82 OUTPUT_BUFFER_ALU.5 | OUTPUT_BUFFER_REG_A.14 v193.68,252.73 194.31,252.09 209.55,252.09 209.55,255.27 210.19,255.91 217.81,255.91 ADDR_REG_A_LOWER.14 | v227.33,281.94 v231.78,286.38 | v191.77,92.71 191.13,92.07
  Bottom 0.152: v120.65,93.98 116.84,97.79 116.84,111.76 RAM_ADDR_LOWER.11 113.03,127.63 107.31,133.35 107.31,146.05 v99.06,146.05 | XOR_GATE2_.1 219.71,35.56 220.98,36.83 220.98,46.99 219.71,48.26 219.71,82.55 218.44,83.82 218.44,87.63 220.34,89.53 v220.34,90.8 | OUTPUT_BUFFER_FLAGS.5 186.06,43.18 186.06,43.81 186.69,44.45 190.5,44.45 190.5,81.28 189.87,81.91 | OUTPUT_BUFFER_CALC_REG.14 189.87,81.91 | 189.87,81.91 v189.87,92.71 | v135.25,92.71 156.21,71.75 DATA_BUS_EXTENSION.4 | 163.19,334.64 v177.17,320.68 | 163.19,334.64 163.19,349.88 DATABUS_4.A | ADDR_MEM_REG_LOWER.14 96.52,275.59 101.6,280.67 104.14,280.67 ADDR_REG_CALC_LOWER1.14 | 133.99,255.27 v133.99,276.86 133.99,305.44 163.19,334.64 | 133.99,255.27 v133.99,236.22 | 133.99,255.27 v134.62,255.27 | 192.41,164.46 193.68,165.73 v193.68,208.28 v193.68,252.73 | 192.41,164.46 OUTPUT_BUFFER_LOGIC.15 | PROGRAM_COUNTER_LOWER.6 231.78,323.21 231.78,316.23 | v231.78,286.38 231.78,316.23 | v227.33,281.94 223.52,278.13 ADDR_REG_A_LOWER.14 | 231.78,316.23 v231.14,316.23 | v191.77,92.71 191.77,116.2 192.41,116.84 192.41,164.46
16_PLACE  (via drill 0.35)
  Top 0.152: v83.82,144.78 v69.85,144.78 64.77,144.78 INSTRUC_REGISTER_UPPER.11 | v127,280.67 128.27,281.94 OUTPUT_BUFFER_PARAM_REG.15 | v97.16,287.65 99.06,289.56 v107.95,289.56 | v124.46,292.1 123.19,293.37 118.11,293.37 117.47,292.74 113.67,292.74 ADDR_REG_PARAM_UPPER.11 | v190.5,86.36 OUTPUT_BUFFER_CALC_REG.15 184.15,90.17 v175.26,90.17 | ADDR_REG_CALC_UPPER.11 203.84,95.88 v197.49,95.88 | v139.06,90.17 OUTPUT_BUFFER_RAM.14 | OUTPUT_BUFFER_FLAGS.6 162.56,22.86 160.66,22.86 159.38,21.59 DATA_BUS_EXTENSION.5 | v184.15,208.28 OUTPUT_BUFFER_ALU.6 | 186.69,160.02 187.96,158.75 OUTPUT_BUFFER_LOGIC.14 | 186.69,160.02 v185.42,161.29 | v186.69,255.27 OUTPUT_BUFFER_REG_A.15 v191.77,255.27 | v201.93,267.97 ADDR_REG_A_UPPER.11 | v193.68,318.77 OUTPUT_BUFFER_PC.15 | v175.26,158.12 177.17,160.02 186.69,160.02 | v182.25,238.76 OUTPUT_BUFFER_MEMORY.15
  Bottom 0.152: RAM_ADDR_UPPER.14 82.55,137.16 83.82,138.43 v83.82,144.78 | OUTPUT_BUFFER_MEMORY.15 127.64,240.66 127.64,245.11 127,245.75 v127,280.67 127,287.65 124.46,290.19 v124.46,292.1 | v97.16,287.65 87.63,278.13 87.63,265.43 ADDR_MEM_REG_UPPER.11 80.01,255.27 76.2,251.46 76.2,242.57 74.93,241.3 74.93,238.76 69.85,233.68 69.85,170.18 70.48,169.54 70.48,149.22 69.85,148.59 v69.85,144.78 | v107.95,289.56 111.76,293.37 ADDR_REG_PARAM_UPPER.11 | OUTPUT_BUFFER_FLAGS.6 186.69,34.29 191.13,34.29 | 193.68,34.29 201.93,34.29 XOR_GATE_.13 | 193.68,34.29 191.13,34.29 | v190.5,86.36 191.13,85.72 191.13,34.29 | v197.49,95.88 195.58,93.98 195.58,59.69 193.68,57.78 193.68,34.29 | v139.06,90.17 158.75,70.48 DATA_BUS_EXTENSION.5 | v185.42,161.29 185.42,207.01 v184.15,208.28 184.15,218.44 186.06,220.34 186.06,238.76 | v186.69,255.27 186.06,254.63 186.06,238.76 | v201.93,267.97 200.66,269.24 200.66,303.53 | 200.66,318.77 200.66,322.58 PROGRAM_COUNTER_UPPER.3 | 200.66,318.77 200.66,303.53 | 200.66,318.77 v193.68,318.77 | DATABUS_5.A 158.75,356.87 187.32,356.87 187.32,320.68 OUTPUT_BUFFER_PC.15 | v191.77,255.27 191.77,262.25 193.04,263.52 193.04,266.7 196.85,270.51 196.85,299.72 200.66,303.53 | v175.26,158.12 v175.26,90.17 | 186.06,238.76 v182.25,238.76
32_PLACE  (via drill 0.35)
  Top 0.152: v83.19,135.25 82.55,135.89 v66.04,135.89 | OUTPUT_BUFFER_CALC_REG.16 192.41,88.9 v193.04,88.26 v205.11,88.26 | OUTPUT_BUFFER_RAM.13 144.15,87.63 v145.42,86.36 | DATA_BUS_EXTENSION.6 161.93,21.59 178.44,38.1 OUTPUT_BUFFER_FLAGS.7 181.61,38.1 182.88,39.37 v193.04,39.37 194.31,39.37 195.58,40.64 207.01,40.64 XOR_GATE_.10 | v95.25,129.54 114.94,129.54 v127,117.47 v130.81,113.66 | v84.46,294 86.36,292.1 v105.41,292.1 106.68,290.83 v121.28,290.83 | v127,241.3 OUTPUT_BUFFER_MEMORY.16 | v126.37,282.57 128.27,284.48 OUTPUT_BUFFER_PARAM_REG.16 132.08,284.48 v133.35,285.75 | OUTPUT_BUFFER_ALU.7 185.42,205.74 v186.06,205.1 187.32,205.1 187.96,204.47 v191.77,204.47 | v202.56,257.81 v192.41,257.81 OUTPUT_BUFFER_REG_A.16 | v201.3,321.31 OUTPUT_BUFFER_PC.16 187.96,321.31 186.69,322.58 175.26,322.58 v162.56,335.28
  Bottom 0.152: RAM_ADDR_UPPER.13 83.19,117.47 83.19,129.54 | v83.19,135.25 83.19,129.54 | v66.04,135.89 60.96,135.89 60.96,145.41 59.69,146.69 INSTRUC_REGISTER_UPPER.12 | v205.11,88.26 204.47,88.9 ADDR_REG_CALC_UPPER.12 | v145.42,86.36 161.29,70.48 DATA_BUS_EXTENSION.6 | v193.04,88.26 193.04,76.2 194.31,74.93 194.31,59.05 193.04,57.78 v193.04,39.37 | v95.25,129.54 83.19,129.54 | v130.81,113.66 131.44,113.03 131.44,108.58 133.99,106.04 133.99,99.69 133.35,99.06 130.18,99.06 130.18,89.53 OUTPUT_BUFFER_RAM.13 | ADDR_MEM_REG_UPPER.12 77.47,276.23 76.84,276.86 76.84,286.38 v84.46,294 | v105.41,292.1 109.22,292.1 ADDR_REG_PARAM_UPPER.12 | DATABUS_6.A 139.7,345.44 139.7,335.28 | 139.7,335.28 139.7,311.78 133.35,305.44 v133.35,285.75 | v121.28,290.83 123.83,290.83 123.83,290.19 126.37,287.65 v126.37,282.57 126.37,241.94 v127,241.3 127,227.97 128.27,226.69 128.27,118.74 v127,117.47 | OUTPUT_BUFFER_LOGIC.13 186.06,159.38 v186.06,205.1 | v202.56,257.81 205.74,260.99 ADDR_REG_A_UPPER.12 206.38,262.25 206.38,266.06 207.01,266.7 207.01,269.88 203.84,273.05 203.84,321.31 | 203.84,321.31 205.11,321.31 205.11,324.49 PROGRAM_COUNTER_UPPER.4 | 203.84,321.31 v201.3,321.31 | v191.77,204.47 191.77,254 192.41,254.63 v192.41,257.81 | v162.56,335.28 139.7,335.28
64_PLACE  (via drill 0.35)
  Top 0.152: OUTPUT_BUFFER_PC.17 191.13,321.94 v192.41,321.94 v206.38,321.94 | 184.79,262.25 v184.15,262.89 | 184.79,262.25 186.06,262.25 187.96,260.35 OUTPUT_BUFFER_REG_A.17 | ADDR_REG_A_UPPER.13 200.66,264.16 v192.41,264.16 186.69,264.16 184.79,262.25 | v179.07,243.84 OUTPUT_BUFFER_MEMORY.17 | OUTPUT_BUFFER_CALC_REG.17 v190.5,91.44 191.13,91.44 193.04,89.53 v201.3,89.53 | 181.61,34.29 182.25,33.66 182.25,22.86 165.74,22.86 164.47,21.59 DATA_BUS_EXTENSION.7 | 181.61,34.29 OUTPUT_BUFFER_FLAGS.8 | v135.25,85.09 OUTPUT_BUFFER_RAM.12 | 89.53,113.66 90.17,113.03 120.65,113.03 v128.91,104.77 | 89.53,113.66 RAM_ADDR_UPPER.12 | INSTRUC_REGISTER_UPPER.13 61.6,142.88 v66.68,142.88 | 89.53,113.66 v73.03,113.66 | 181.61,34.29 v207.65,34.29 | v184.15,203.2 OUTPUT_BUFFER_ALU.8 | v184.79,156.84 187.96,153.67 OUTPUT_BUFFER_LOGIC.12
  Bottom 0.152: OUTPUT_BUFFER_MEMORY.17 127.64,245.75 127.64,285.12 128.91,286.38 | ADDR_REG_PARAM_UPPER.13 106.68,301.62 109.22,304.16 109.22,306.07 110.49,307.34 119.38,307.34 119.38,306.07 125.09,300.36 125.09,290.19 127.64,287.65 | 128.91,286.38 127.64,287.65 | 128.91,286.38 OUTPUT_BUFFER_PARAM_REG.17 | DATABUS_7.A 132.72,346.07 132.72,300.36 127.64,295.27 127.64,287.65 | v206.38,321.94 208.28,323.85 PROGRAM_COUNTER_UPPER.5 | OUTPUT_BUFFER_ALU.8 179.07,205.74 v179.07,243.84 179.07,252.73 180.34,254 184.15,254 v184.15,262.89 | v192.41,264.16 v192.41,321.94 | ADDR_REG_CALC_UPPER.13 201.93,90.17 v201.3,89.53 203.2,87.63 203.2,83.82 207.01,80.01 207.01,48.26 208.28,46.99 208.28,36.83 208.91,36.19 208.91,34.29 | XOR_GATE_.5 208.91,31.11 208.91,34.29 | OUTPUT_BUFFER_LOGIC.12 191.13,151.76 191.13,116.84 190.5,116.2 v190.5,91.44 | v135.25,85.09 154.94,65.41 154.94,20.95 155.57,20.32 163.83,20.32 DATA_BUS_EXTENSION.7 | v128.91,104.77 128.91,88.26 OUTPUT_BUFFER_RAM.12 | 68.58,140.97 69.85,139.7 69.85,116.84 v73.03,113.66 | 68.58,140.97 v66.68,142.88 | ADDR_MEM_REG_UPPER.13 73.66,256.54 73.66,242.57 72.39,241.3 72.39,237.49 68.58,233.68 68.58,166.37 69.85,165.1 69.85,149.22 68.58,147.95 68.58,140.97 | v207.65,34.29 208.91,34.29 | v184.15,203.2 184.79,202.56 v184.79,156.84
128_PLACE  (via drill 0.35)
  Top 0.152: ADDR_REG_A_UPPER.14 198.75,263.52 v193.68,263.52 190.5,263.52 189.87,262.89 OUTPUT_BUFFER_REG_A.18 v186.69,262.89 | PROGRAM_COUNTER_UPPER.6 208.91,323.21 197.49,323.21 194.31,326.39 OUTPUT_BUFFER_PC.18 187.96,326.39 v186.06,324.49 | v72.39,290.19 73.66,291.46 v103.5,291.46 | v125.73,246.38 OUTPUT_BUFFER_MEMORY.18 | 127.64,288.93 128.27,289.56 OUTPUT_BUFFER_PARAM_REG.18 130.81,289.56 133.99,286.38 160.66,286.38 v161.29,287.02 | 127.64,288.93 v125.73,287.02 | 127.64,288.93 v127,289.56 | v47.62,140.33 INSTRUC_REGISTER_UPPER.14 | DATA_BUS_EXTENSION.8 167.64,20.32 v172.09,20.32 | OUTPUT_BUFFER_CALC_REG.18 v191.13,93.98 193.04,93.98 193.68,94.61 197.49,94.61 ADDR_REG_CALC_UPPER.14 | OUTPUT_BUFFER_ALU.9 183.51,200.66 v184.15,200.02 184.79,200.02 185.42,199.39 190.5,199.39 v193.04,201.93 | OUTPUT_BUFFER_FLAGS.9 178.44,34.92 178.44,36.83 v191.77,36.83 | OUTPUT_BUFFER_RAM.11 133.99,84.45 140.97,84.45 v143.51,87
  Bottom 0.152: v186.69,262.89 186.06,263.52 186.06,306.7 | v186.06,324.49 186.06,306.7 | v72.39,290.19 ADDR_MEM_REG_UPPER.14 | v103.5,291.46 104.14,292.1 ADDR_REG_PARAM_UPPER.14 106.05,296.54 106.05,302.89 108.59,305.44 108.59,306.07 110.49,307.98 120.65,307.98 120.65,307.34 126.37,301.62 126.37,298.45 128.27,296.54 | v125.73,287.02 v125.73,246.38 | DATABUS_8.A 132.08,350.52 132.08,300.36 128.27,296.54 | 128.27,296.54 127,295.27 v127,289.56 | 186.06,306.7 161.29,306.7 v161.29,287.02 | OUTPUT_BUFFER_RAM.11 127,77.47 127,76.83 126.37,76.2 92.71,76.2 92.71,76.83 | 92.71,76.83 92.71,105.41 91.44,106.68 91.44,113.66 90.17,114.93 RAM_ADDR_UPPER.11 | v47.62,140.33 47.62,96.52 67.31,76.83 92.71,76.83 | 182.25,31.11 186.06,27.3 198.12,27.3 199.39,28.57 201.93,28.57 XOR_GATE_.2 | 182.25,31.11 OUTPUT_BUFFER_FLAGS.9 | v172.09,20.32 182.25,20.32 182.25,31.11 | 185.42,154.94 184.15,156.21 v184.15,200.02 | 185.42,154.94 OUTPUT_BUFFER_LOGIC.11 | 185.42,154.94 190.5,154.94 191.77,153.67 191.77,116.84 191.13,116.2 v191.13,93.98 191.13,92.07 191.77,91.44 v191.77,36.83 | v143.51,87 166.37,87 DATA_BUS_EXTENSION.8 | v193.68,263.52 193.04,262.89 v193.04,201.93
+5V
  Top 0.152: AUTO_CLOCK.8 93.98,335.28 R1.1
  Bottom 0.152: STEPPER_CLOCK.8 26.67,340.36 31.75,335.28 R3.2 48.26,335.28 48.26,332.74 R2.1 52.71,334.64 52.71,349.88 54.61,351.79 65.41,351.79 65.41,349.25 CLK_MODE.3 66.04,348.62 70.48,348.62 78.11,341 78.11,339.73 R1.1 | AUTO_CLOCK.4 100.33,332.74 100.33,339.09 99.06,340.36 94.62,340.36 94.62,339.73 AUTO_CLOCK.8
CLOCK  (via drill 0.35)
  Top 0.152: ADDR_MEM_REG_LOWER.7 104.78,252.09 84.46,252.09 ADDR_MEM_REG_UPPER.7 80.01,252.73 v69.22,252.73 | v24.13,296.54 24.77,295.91 31.75,295.91 33.02,297.18 AND_GATE_.8 | 202.56,327.02 PROGRAM_COUNTER_UPPER.2 | 202.56,327.02 221.62,327.02 PROGRAM_COUNTER_LOWER.2 225.43,327.02 239.4,327.02 240.03,326.39 240.03,322.58 v237.49,322.58 | ADDR_REG_A_UPPER.7 212.72,252.09 231.78,252.09 233.05,253.36 | RAM_ADDR_UPPER.7 94.62,106.04 113.67,106.04 RAM_ADDR_LOWER.7 | v207.65,59.05 183.51,59.05 v177.8,53.34 149.86,53.34 v114.94,88.26 | ADDR_REG_CALC_LOWER.7 230.5,83.19 211.46,83.19 ADDR_REG_CALC_UPPER.7 | v238.12,248.28 233.05,253.36 | 233.05,253.36 ADDR_REG_A_LOWER.7 | CLOCK.A 84.46,360.04 v85.09,360.04 | v196.85,326.39 197.49,327.02 202.56,327.02
  Bottom 0.152: ADDR_REG_PARAM_UPPER.7 113.03,285.75 113.03,281.94 114.3,280.67 ADDR_REG_CALC_LOWER1.7 114.3,269.88 107.95,263.52 107.95,251.46 ADDR_MEM_REG_LOWER.7 | AND_GATE_.8 38.1,300.99 44.45,300.99 44.45,318.77 45.72,320.04 | 45.72,320.04 62.23,336.55 CLOCK.A | NOT_GATE1.11 24.13,300.99 v24.13,296.54 | v69.22,252.73 64.77,257.18 64.77,300.36 45.72,319.4 45.72,320.04 | v237.49,322.58 237.49,279.4 234.95,276.86 234.95,255.27 ADDR_REG_A_LOWER.7 | FLAG_REG_LOWER.7 233.05,50.16 233.05,55.25 232.41,55.88 232.41,73.66 | ADDR_REG_CALC_LOWER.7 232.41,73.66 | 209.55,59.05 209.55,51.44 210.82,50.16 FLAG_REG_UPPER.7 | 209.55,59.05 ADDR_REG_CALC_UPPER.7 | CLK_EXTENSION.1 177.8,26.67 v177.8,53.34 | 209.55,59.05 v207.65,59.05 | RAM_ADDR_LOWER.7 115.57,88.9 v114.94,88.26 | v238.12,248.28 268.61,217.8 268.61,112.39 247.65,91.44 247.65,74.93 246.38,73.66 232.41,73.66 | v85.09,360.04 196.85,360.04 v196.85,326.39
CTRL_SIG_5  (via drill 0.35)
  Top 0.152: SELECTOR_.13 85.09,199.39 v103.5,199.39
  Bottom 0.152: v103.5,199.39 106.68,196.22 106.68,149.86 INSTRUCTION_MEMORY_LOWER.16
CTRL_SIG_6  (via drill 0.35)
  Top 0.152: SELECTOR_.14 82.55,204.47 v103.5,204.47
  Bottom 0.152: v103.5,204.47 107.31,200.66 107.31,151.76 INSTRUCTION_MEMORY_LOWER.17
CTRL_SIG_9_(CALC_REG_IN)  (via drill 0.35)
  Top 0.152: NOT_GATE2_.3 16.51,292.1 v20.32,292.1 | v42.55,193.04 47.62,187.96 INSTRUCTION_MEMORY_UPPER.11
  Bottom 0.152: v20.32,292.1 22.23,292.1 22.23,271.14 21.59,270.51 17.78,270.51 17.78,217.8 v42.55,193.04
CTRL_SIG_10_(CALC_REG_OUT)  (via drill 0.35)
  Top 0.152: v8.26,293.37 NOT_GATE2_.1 | v46.36,198.12 v6.35,238.12 | v56.52,187.32 58.42,185.42 INSTRUCTION_MEMORY_UPPER.12
  Bottom 0.152: v8.26,293.37 6.35,291.46 v6.35,238.12 | v46.36,198.12 56.52,187.96 v56.52,187.32
CTRL_SIG_11_(SUM_OUT)  (via drill 0.35)
  Top 0.152: v18.42,269.24 NOT_GATE3_.3 | v43.18,191.13 51.44,182.88 INSTRUCTION_MEMORY_UPPER.13
  Bottom 0.152: v18.42,269.24 18.42,218.44 43.18,193.67 v43.18,191.13
CTRL_SIG_12_(SUBTRACT)  (via drill 0.35)
  Top 0.152: ADDER_LOWER.7 212.72,190.5 210.19,193.04 SUBTRACT_INVRTR_LOWER_.9 | INSTRUCTION_MEMORY_UPPER.15 113.03,181.61 v198.75,181.61
  Bottom 0.152: SUBTRACT_INVRTR_LOWER_.9 206.38,194.94 206.38,198.75 | SUBTRACT_INVRTR_LOWER_.12 206.38,198.75 | 206.38,211.45 SUBTRACT_INVRTR_UPPER_.9 | 206.38,198.75 206.38,210.19 | 206.38,210.19 206.38,211.45 | SUBTRACT_INVRTR_UPPER_.12 206.38,219.07 206.38,211.45 | 198.75,196.22 v198.75,181.61 | SUBTRACT_INVRTR_LOWER_.4 198.75,196.22 | 198.75,203.83 SUBTRACT_INVRTR_LOWER_.1 | 198.75,196.22 198.75,203.83 | 198.75,216.53 SUBTRACT_INVRTR_UPPER_.4 203.84,215.26 203.84,210.19 206.38,210.19 | 198.75,203.83 198.75,216.53 | SUBTRACT_INVRTR_UPPER_.1 198.75,224.16 198.75,216.53
FLAG_OUT  (via drill 0.35)
  Top 0.152: INSTRUCTION_MEMORY_UPPER2.11 119.38,186.69 v135.89,186.69 | v165.74,156.84 166.37,157.48 193.04,157.48 196.85,153.67 200.03,153.67 201.3,152.4 NOT_GATE.11
  Bottom 0.152: v165.74,156.84 v135.89,186.69
FLAG_TOGGLE_IN  (via drill 0.35)
  Top 0.152: INSTRUCTION_MEMORY_UPPER.16 110.49,181.61 87,181.61 86.36,182.25 v69.22,182.25 | v69.22,233.04 52.07,250.19 v40.64,250.19 | v30.48,310.51 28.58,308.61 22.86,308.61 21.59,309.88 NOT_GATE1.13
  Bottom 0.152: v69.22,233.04 v69.22,182.25 | v40.64,250.19 32.39,258.44 32.39,277.5 30.48,279.4 v30.48,310.51
GND  (via drill 0.35)
  Top 0.152: R4.1 47.62,350.52 47.62,340.36 C2.- 46.99,340.36 46.99,334.01 27.31,334.01 26.04,332.74 STEPPER_CLOCK.1 | 38.74,258.44 38.1,257.81 29.21,257.81 27.94,259.08 AND_GATE3_.7 | NOT_GATE1.7 13.97,295.91 22.23,295.91 23.5,297.18 AND_GATE_.7 | INSTRUC_REGISTER_LOWER.1 INSTRUC_REGISTER_UPPER.8 | R39.2 R38.2 | R33.2 R32.2 | R35.2 R34.2 | v92.71,142.24 INSTRUCTION_MEMORY_LOWER.14 | RAM_ADDR_LOWER.8 116.21,109.85 104.78,109.85 RAM_ADDR_LOWER.2 RAM_ADDR_LOWER.1 RAM_ADDR_UPPER.8 | RAM.24 RAM.23 | RAM.14 101.6,91.44 RAM.20 | R71.2 R76.2 96.52,278.13 ADDR_REG_CALC_LOWER1.1 | INSTRUCTION_MEMORY_UPPER2.22 132.08,199.39 114.94,199.39 113.67,198.12 INSTRUCTION_MEMORY_UPPER.22 | R42.1 R40.1 | R45.1 R41.1 R43.1 71.12,190.5 SELECTOR_.8 | 95.25,179.07 INSTRUCTION_MEMORY_UPPER.14 | MICRO_COUNTER_LOWER.9 95.25,179.07 | INSTRUCTION_MEMORY_UPPER2.14 116.84,179.07 v113.67,179.07 95.25,179.07 | ADDR_MEM_REG_UPPER.1 ADDR_MEM_REG_UPPER.2 71.76,248.28 83.19,248.28 ADDR_MEM_REG_UPPER.8 ADDR_MEM_REG_LOWER.1 | SELECTOR_.15 78.74,210.82 SELECTOR_.1 | MEMORY.21 MEMORY.20 | OUTPUT_BUFFER_MEMORY.10 118.11,224.79 MEMORY.14 | 38.74,258.44 41.28,255.91 67.95,255.91 ADDR_MEM_REG_UPPER.15 | 38.74,258.44 NOT_GATE2_1.7 | R49.2 248.92,147.32 R6.2 | XOR_GATE_.7 216.53,32.38 233.05,32.38 XOR_GATE2_.7 | R10.1 R11.1 | R13.1 R12.1 241.3,44.45 FLAG_REG_LOWER.8 234.31,51.44 222.88,51.44 FLAG_REG_LOWER.2 FLAG_REG_LOWER.1 FLAG_REG_UPPER.8 | ADDR_REG_CALC_LOWER.8 240.03,90.17 R68.2 R63.2 | R67.2 R64.2 | LOGIC_SELECTOR-XOR/NOT_UPPER.8 190.5,116.84 199.39,116.84 200.66,118.11 LOGIC_SELECTOR-XOR/NOT_LOWER.8 203.2,116.84 220.98,116.84
  Top 0.152: 220.98,116.84 LOGIC_SELECTOR-AND/OR_UPPER.8 | 220.98,116.84 229.87,116.84 231.14,118.11 LOGIC_SELECTOR-AND/OR_LOWER.8 | ADDR_REG_CALC_UPPER.1 ADDR_REG_CALC_UPPER.2 198.75,87 210.19,87 ADDR_REG_CALC_UPPER.8 ADDR_REG_CALC_LOWER.1 ADDR_REG_CALC_LOWER.2 | FLAG_REG_UPPER.2 FLAG_REG_UPPER.1 186.06,49.53 186.06,50.8 185.42,51.44 182.25,51.44 OUTPUT_BUFFER_FLAGS.1 | NOT_GATE.7 199.39,146.05 208.28,146.05 209.55,144.78 AND_GATE1_.7 212.09,144.78 213.36,146.05 222.25,146.05 AND_GATE2_.7 | OR_GATE.7 202.56,167 202.56,168.91 213.36,168.91 OR_GATE_2.7 | SUBTRACT_INVRTR_LOWER_.7 203.2,187.96 ADDER_LOWER.8 | ADDR_REG_A_LOWER.1 ADDR_REG_A_UPPER.8 | ADDR_REG_A_LOWER.8 234.31,255.91 222.88,255.91 ADDR_REG_A_LOWER.2 | R59.2 R60.2 | R56.2 R57.2 | 153.04,344.81 152.4,345.44 140.34,345.44 139.06,344.17 R29.2 | 153.04,344.81 R28.2 | R20.2 R21.2 R22.2 R23.2 | OUTPUT_BUFFER_PC.10 182.88,309.88 R16.2 R17.2 R18.2 R19.2 | R26.2 182.88,345.44 170.81,345.44 | 170.81,345.44 169.55,344.17 R27.2 | PROGRAM_COUNTER_LOWER.8 236.86,323.21 218.44,323.21 216.53,325.12 PROGRAM_COUNTER_UPPER.8 | 153.04,344.81 153.67,345.44 170.81,345.44 | v80.65,341 78.11,341 77.47,340.36 C1.-
  Bottom 0.152: R5.1 53.34,332.74 53.34,345.44 | 53.34,345.44 53.34,349.25 R4.1 | 53.34,345.44 71.76,345.44 76.84,340.36 C1.- | NOT_GATE3_.7 14.61,260.99 14.61,276.23 | NOT_GATE2_.7 14.61,276.23 | NOT_GATE1.7 14.61,295.27 14.61,276.23 | 24.77,332.74 16.51,332.74 CLK_TRIGGER.3 | AND_GATE3_.7 24.77,260.99 24.77,276.23 | AND_GATE1.7 24.77,276.23 | 24.77,295.27 AND_GATE_.7 | 24.77,276.23 24.77,295.27 | OR_GATE1.7 37.47,295.27 37.47,260.99 NOT_GATE2_1.7 | 24.77,295.27 24.77,332.74 | 24.77,332.74 STEPPER_CLOCK.1 | INSTRUC_REGISTER_UPPER.1 INSTRUC_REGISTER_UPPER.2 52.71,139.06 52.71,138.43 59.06,132.08 66.04,132.08 | INSTRUC_REGISTER_LOWER.1 INSTRUC_REGISTER_LOWER.2 | 66.04,132.08 67.31,132.08 INSTRUC_REGISTER_UPPER.8 66.04,140.97 66.04,153.03 66.68,153.67 66.68,189.87 R43.1 | R39.2 RAM.1 RAM.2 86.36,81.28 RAM.26 | R37.2 69.85,88.9 | 69.85,88.9 68.58,88.9 | 68.58,88.9 R36.2 | 69.85,88.9 69.85,97.79 R35.2 | R33.2 67.31,105.41 R34.2 | R38.2 68.58,80.01 68.58,88.9 | 66.04,132.08 66.04,110.49 R32.2 | RAM_ADDR_LOWER.2 RAM_ADDR_LOWER.15 102.87,117.47 101.6,118.74 101.6,124.46 92.71,133.35 92.71,137.16 INSTRUC_REGISTER_LOWER.8 v92.71,142.24 | RAM.14 124.46,78.74 OUTPUT_BUFFER_RAM.10 | RAM_ADDR_UPPER.2 RAM_ADDR_UPPER.1 | RAM_ADDR_UPPER.2 RAM_ADDR_UPPER.15 | RAM.20 RAM.21 93.98,99.06 | RAM.26 RAM.25 RAM.24 | RAM_ADDR_UPPER.8 93.98,106.68 93.98,99.06 | RAM.23 93.98,99.06 | RAM_ADDR_UPPER.2 80.01,100.33 RAM.26 | ADDR_REG_PARAM_UPPER.2 100.33,287.02 | 100.33,287.02 ADDR_REG_PARAM_UPPER.1 | ADDR_REG_CALC_LOWER1.2 ADDR_REG_CALC_LOWER1.1 | 88.9,270.51 88.9,276.86 R76.2 | 88.9,270.51 88.9,269.24 R69.2 88.27,266.06 88.27,255.27 85.09,252.09 ADDR_MEM_REG_UPPER.8
  Bottom 0.152: R71.2 83.82,279.4 83.82,287.02 R70.2 93.98,297.18 AUTO_CLOCK.1 | 100.33,287.02 100.33,281.94 88.9,270.51 | OUTPUT_BUFFER_PARAM_REG.10 121.92,270.51 | 121.92,270.51 121.92,262.89 ADDR_MEM_REG_LOWER.8 109.22,241.3 OUTPUT_BUFFER_MEMORY.10 | 121.92,270.51 ADDR_REG_CALC_LOWER1.8 116.84,277.5 115.57,278.76 115.57,285.75 ADDR_REG_PARAM_UPPER.8 | INSTRUCTION_MEMORY_UPPER2.20 131.44,194.94 131.44,196.22 INSTRUCTION_MEMORY_UPPER2.22 | INSTRUCTION_MEMORY_LOWER.20 113.67,156.84 113.67,158.12 INSTRUCTION_MEMORY_LOWER.22 113.67,161.92 v113.67,179.07 113.67,194.94 | 113.67,194.94 INSTRUCTION_MEMORY_UPPER.20 | 113.67,194.94 113.67,196.22 INSTRUCTION_MEMORY_UPPER.22 | R42.1 62.23,200.66 | 62.23,200.66 R44.1 67.95,200.66 67.95,249.56 ADDR_MEM_REG_UPPER.1 | MICRO_COUNTER_UPPER.8 MICRO_COUNTER_UPPER.9 60.96,181.61 R41.1 62.23,191.77 62.23,200.66 | MICRO_COUNTER_LOWER.8 MICRO_COUNTER_LOWER.9 88.9,222.88 | ADDR_MEM_REG_UPPER.2 ADDR_MEM_REG_UPPER.15 | ADDR_MEM_REG_LOWER.15 ADDR_MEM_REG_LOWER.2 ADDR_MEM_REG_LOWER.1 MEMORY.20 | MEMORY.2 SELECTOR_.1 | MEMORY.24 MEMORY.23 85.09,240.03 | 85.09,240.03 MEMORY.22 MEMORY.21 | MEMORY.14 102.23,222.88 88.9,222.88 | 85.09,222.88 88.9,222.88 | 85.09,240.03 85.09,222.88 | SELECTOR_.15 85.09,212.09 85.09,222.88 | SUBTRACT_INVRTR_LOWER_1.7 248.92,209.55 248.92,205.74 249.56,205.1 249.56,200.02 SUBTRACT_INVRTR_UPPER_1.7 250.19,167.64 245.11,162.56 R48.2 R46.2 R49.2 R52.2 | R51.2 R47.2 R50.2 R6.2 R64.2 R61.2 | FLAG_REG_LOWER.8 236.22,31.75 XOR_GATE2_.7 | 246.38,34.29 R9.1 R10.1 | 246.38,34.29 R8.1 | 246.38,34.29 246.38,43.18 R13.1 R14.1 251.46,48.26 R15.2 255.27,80.01
  Bottom 0.152: 255.27,80.01 R65.2 257.81,87.63 R66.2 | 255.27,80.01 254,80.01 | 254,80.01 R62.2 | R63.2 254,88.9 254,80.01 | R68.2 R67.2 | OUTPUT_BUFFER_REG_A.10 OUTPUT_BUFFER_ALU.1 183.51,219.07 183.51,196.22 | OUTPUT_BUFFER_LOGIC.10 183.51,153.03 183.51,172.72 | 183.51,196.22 183.51,172.72 | OUTPUT_BUFFER_ALU.10 183.51,196.22 | OUTPUT_BUFFER_FLAGS.10 178.44,32.38 178.44,51.44 OUTPUT_BUFFER_FLAGS.1 OUTPUT_BUFFER_CALC_REG.10 | FLAG_REG_UPPER.2 FLAG_REG_UPPER.15 196.85,58.42 ADDR_REG_CALC_UPPER.2 198.12,86.36 198.12,116.84 198.75,117.47 198.75,144.14 NOT_GATE.7 196.22,146.69 196.22,167.64 200.03,171.45 200.03,189.87 SUBTRACT_INVRTR_LOWER_.7 202.56,192.41 202.56,208.91 SUBTRACT_INVRTR_UPPER_.7 | FLAG_REG_LOWER.2 FLAG_REG_LOWER.15 220.98,83.82 ADDR_REG_CALC_LOWER.2 | LOGIC_SELECTOR-AND/OR_UPPER.8 217.81,116.2 217.81,94.61 218.44,93.98 218.44,88.26 217.17,87 ADDR_REG_CALC_LOWER.1 | 183.51,172.72 177.8,172.72 177.8,129.54 LOGIC_SELECTOR-XOR/NOT_UPPER.8 | 217.81,208.91 217.81,189.87 ADDER_LOWER.8 219.71,165.1 OR_GATE_2.7 | ADDER_UPPER.8 217.81,208.91 | ADDR_REG_A_LOWER.2 ADDR_REG_A_LOWER.1 217.17,255.27 R59.2 R58.2 R57.2 | ADDR_REG_A_UPPER.2 ADDR_REG_A_UPPER.1 194.31,255.27 R53.2 R54.2 199.39,266.7 | 199.39,266.7 R55.2 R56.2 | R29.2 139.06,344.81 139.06,351.15 139.7,351.79 139.7,354.33 137.16,356.87 R30.2 R31.2 107.31,356.87 91.44,341 v80.65,341 | R24.2 193.04,356.87 | 193.04,356.87 R25.2 | PROGRAM_COUNTER_UPPER.8 214.63,323.85 214.63,320.04 205.74,311.15 R19.2 | R27.2 179.07,334.01 179.07,311.15 OUTPUT_BUFFER_PC.10 | POWER.1 260.35,349.25 260.35,327.66 251.46,318.77 238.76,318.77 PROGRAM_COUNTER_LOWER.8
  Bottom 0.152: 193.04,311.15 193.04,356.87 | R16.2 193.04,311.15 | R20.2 193.04,300.99 193.04,311.15 | 199.39,266.7 199.39,298.45 R21.2 | 217.81,208.91 212.09,208.91 212.09,252.73 ADDR_REG_A_UPPER.8
HLT_SIGNAL  (via drill 0.35)
  Top 0.152: v108.59,190.5 INSTRUCTION_MEMORY_UPPER.19 | v94.62,255.27 93.98,255.91 v79.38,255.91
  Bottom 0.152: v108.59,190.5 107.95,191.13 107.95,246.38 105.41,248.92 105.41,251.46 101.6,255.27 v94.62,255.27 | v79.38,255.91 76.2,255.91 76.2,264.16 73.03,267.33 73.03,324.49 83.82,335.28 83.82,336.55 67.31,353.06 9.53,353.06 9.53,315.6 NOT_GATE1.1
INSTRUCTION__A4  (via drill 0.35)
  Top 0.152: INSTRUCTION_MEMORY_UPPER2.6 115.57,200.66 114.3,199.39 110.49,199.39 109.22,200.66 INSTRUCTION_MEMORY_UPPER.6 v93.98,200.66 | v65.41,154.31 69.85,158.75 v94.62,158.75
  Bottom 0.152: INSTRUC_REGISTER_UPPER.6 61.6,140.33 61.6,145.41 60.96,146.05 60.96,149.86 v65.41,154.31 | v94.62,158.75 94.62,160.65 95.89,161.92 | v93.98,200.66 93.34,200.02 93.34,164.46 95.89,161.92 | 95.89,161.92 INSTRUCTION_MEMORY_LOWER.6
INSTRUCTION_A1  (via drill 0.35)
  Top 0.152: INSTRUCTION_MEMORY_UPPER.10 v102.23,190.5 107.31,190.5 108.59,189.23 115.57,189.23 116.84,190.5 INSTRUCTION_MEMORY_UPPER2.10
  Bottom 0.152: INSTRUC_REGISTER_LOWER.6 88.9,143.51 93.34,143.51 93.34,149.22 INSTRUCTION_MEMORY_LOWER.10 100.33,156.21 100.33,190.5 v102.23,190.5
INSTRUCTION_A2  (via drill 0.35)
  Top 0.152: INSTRUCTION_MEMORY_UPPER2.9 116.84,193.04 115.57,194.31 110.49,194.31 109.22,193.04 INSTRUCTION_MEMORY_UPPER.9 v92.08,193.04
  Bottom 0.152: INSTRUC_REGISTER_LOWER.5 83.19,140.33 83.19,145.41 83.82,146.05 83.82,148.59 90.81,155.57 92.08,155.57 | 92.08,155.57 96.52,155.57 INSTRUCTION_MEMORY_LOWER.9 | 92.08,155.57 v92.08,193.04
INSTRUCTION_A3  (via drill 0.35)
  Top 0.152: INSTRUCTION_MEMORY_UPPER2.8 116.84,195.58 115.57,196.85 97.79,196.85 INSTRUCTION_MEMORY_UPPER.8 v92.71,195.58 | INSTRUC_REGISTER_LOWER.4 80.01,144.14 v87.63,144.14 | v92.71,154.94 95.25,157.48 INSTRUCTION_MEMORY_LOWER.8
  Bottom 0.152: v87.63,144.14 92.71,144.14 v92.71,154.94 | v92.71,195.58 92.71,159.38 94.62,157.48 INSTRUCTION_MEMORY_LOWER.8
INSTRUCTION_A4  (via drill 0.35)
  Top 0.152: v83.82,159.38 84.46,160.02 INSTRUCTION_MEMORY_LOWER.7 108.59,160.02 109.86,161.29 113.03,161.29 v116.21,164.46 | v93.98,198.12 INSTRUCTION_MEMORY_UPPER.7
  Bottom 0.152: INSTRUC_REGISTER_LOWER.3 78.74,140.97 78.74,154.31 v83.82,159.38 | v93.98,198.12 93.98,165.1 95.25,163.83 98.43,163.83 98.43,161.92 INSTRUCTION_MEMORY_LOWER.7 | INSTRUCTION_MEMORY_UPPER2.7 116.21,196.22 v116.21,164.46
INSTRUCTION_A5  (via drill 0.35)
  Top 0.152: INSTRUCTION_MEMORY_UPPER.5 97.79,201.93 v102.23,201.93 113.67,201.93 114.94,203.2 INSTRUCTION_MEMORY_UPPER2.5 | INSTRUC_REGISTER_UPPER.5 62.23,142.24 v71.12,142.24 | v87,164.46 87.63,165.1 INSTRUCTION_MEMORY_LOWER.5
  Bottom 0.152: v71.12,142.24 71.12,148.59 82.55,160.02 85.09,160.02 85.09,161.92 87,163.83 v87,164.46 | v102.23,201.93 99.7,201.93 99.7,168.27 INSTRUCTION_MEMORY_LOWER.5
INSTRUCTION_A6  (via drill 0.35)
  Top 0.152: INSTRUCTION_MEMORY_UPPER.4 v101.6,205.74 106.68,205.74 108.59,203.83 109.86,203.83 110.49,204.47 113.67,204.47 114.94,205.74 INSTRUCTION_MEMORY_UPPER2.4 | v66.04,167 66.68,167.64 INSTRUCTION_MEMORY_LOWER.4
  Bottom 0.152: INSTRUC_REGISTER_UPPER.4 60.33,136.52 60.33,135.89 60.96,135.25 66.68,135.25 66.68,136.52 65.41,137.79 63.5,137.79 63.5,151.13 66.04,153.67 v66.04,167 | v101.6,205.74 99.06,205.74 99.06,170.18 INSTRUCTION_MEMORY_LOWER.4
INSTRUCTION_A7  (via drill 0.35)
  Top 0.152: v66.04,168.27 66.68,168.91 93.98,168.91 95.25,170.18 INSTRUCTION_MEMORY_LOWER.3 | INSTRUCTION_MEMORY_UPPER2.3 116.84,209.55 99.06,209.55 97.79,208.28 INSTRUCTION_MEMORY_UPPER.3
  Bottom 0.152: INSTRUC_REGISTER_UPPER.3 58.42,143.51 58.42,148.59 65.41,155.57 65.41,167.64 v66.04,168.27 | INSTRUCTION_MEMORY_UPPER.3 98.43,206.38 98.43,172.08 INSTRUCTION_MEMORY_LOWER.3
INSTRUCTION_REG_IN  (via drill 0.35)
  Top 0.152: INSTRUC_REGISTER_UPPER.10 INSTRUC_REGISTER_UPPER.9 67.95,147.32 69.85,145.41 85.73,145.41 INSTRUC_REGISTER_LOWER.10 | MICRO_COUNTER_LOWER.1 70.48,171.45 68.58,169.54 v67.31,169.54 47.62,169.54 MICRO_COUNTER_UPPER.1 v41.91,171.45 | v5.72,264.8 NOT_GATE3_.2 | INSTRUCTION_MEMORY_UPPER.18 99.06,187.96 97.79,189.23 v76.2,189.23
  Bottom 0.152: INSTRUC_REGISTER_LOWER.9 INSTRUC_REGISTER_LOWER.10 | v5.72,264.8 5.72,237.49 9.53,233.68 9.53,173.35 11.43,171.45 v41.91,171.45 | v76.2,189.23 72.39,185.42 72.39,172.72 MICRO_COUNTER_LOWER.1 | v67.31,169.54 INSTRUC_REGISTER_UPPER.9
INV_HLT_SIGNAL
  Top 0.152: NOT_GATE1.2 11.43,309.88 10.16,308.61 10.16,303.53 16.51,303.53 19.05,300.99 31.75,300.99 33.02,299.72 AND_GATE_.9
INVERTED_CLOCK  (via drill 0.35)
  Top 0.152: INSTRUC_REGISTER_UPPER.7 66.68,137.79 v72.39,137.79 85.73,137.79 INSTRUC_REGISTER_LOWER.7 | v23.5,272.41 25.4,270.51 27.94,270.51 v33.02,265.43 | MICRO_COUNTER_LOWER.2 71.76,173.35 50.17,173.35 MICRO_COUNTER_UPPER.2
  Bottom 0.152: NOT_GATE1.10 23.5,299.08 v23.5,272.41 | v33.02,265.43 36.83,265.43 36.83,255.27 41.28,250.82 41.28,216.53 INVERTED_CLK_LED.A 44.45,175.26 MICRO_COUNTER_UPPER.2 | v72.39,137.79 70.48,137.79 70.48,148.59 71.12,149.22 71.12,168.91 MICRO_COUNTER_LOWER.2
LOGIC_1  (via drill 0.35)
  Top 0.152: LOGIC_SELECTOR-XOR/NOT_LOWER.4 200.66,128.27 199.39,127 187.96,127 v184.15,130.81 | v205.11,116.2 v227.97,116.2 | v256.54,137.16 241.3,121.92 v234.31,121.92
  Bottom 0.152: v184.15,130.81 179.07,130.81 179.07,160.02 179.7,160.65 179.7,169.54 OUTPUT_BUFFER_LOGIC.2 | LOGIC_SELECTOR-AND/OR_LOWER.4 230.5,126.36 230.5,121.92 | 230.5,121.92 230.5,118.74 v227.97,116.2 | v205.11,116.2 200.03,116.2 200.03,126.36 LOGIC_SELECTOR-XOR/NOT_LOWER.4 | LOGIC_LED_1.A 256.54,157.48 v256.54,137.16 | 230.5,121.92 v234.31,121.92
LOGIC_2  (via drill 0.35)
  Top 0.152: 235.59,119.38 235.59,120.65 LOGIC_SELECTOR-AND/OR_LOWER.7 | 235.59,119.38 235.59,118.74 232.41,115.57 v206.38,115.57 180.34,115.57 v173.36,122.55 | OUTPUT_BUFFER_LOGIC.3 175.9,163.19 v174.62,163.19 | v243.84,116.84 241.3,119.38 235.59,119.38
  Bottom 0.152: LOGIC_SELECTOR-XOR/NOT_LOWER.7 206.38,116.2 v206.38,115.57 | v174.62,163.19 173.36,161.92 v173.36,122.55 | LOGIC_LED_2.A 252.09,158.12 252.09,125.09 v243.84,116.84
LOGIC_3  (via drill 0.35)
  Top 0.152: v212.72,109.22 213.36,108.58 v222.88,108.58 | OUTPUT_BUFFER_LOGIC.4 182.88,165.1 194.31,165.1 198.12,161.29 v201.93,161.29 | v207.01,118.74 207.65,118.11 LOGIC_SELECTOR-XOR/NOT_LOWER.9 | LOGIC_LED_3.A 253.37,168.27 v249.56,168.27
  Bottom 0.152: LOGIC_SELECTOR-XOR/NOT_LOWER.9 212.72,114.93 v212.72,109.22 | v222.88,108.58 238.76,108.58 238.76,116.84 LOGIC_SELECTOR-AND/OR_LOWER.9 241.94,120.01 241.94,168.27 v249.56,168.27 | v201.93,161.29 201.93,153.03 201.3,152.4 201.3,139.06 203.84,136.52 203.84,121.92 v207.01,118.74
LOGIC_4  (via drill 0.35)
  Top 0.152: OUTPUT_BUFFER_LOGIC.5 186.69,163.83 187.96,162.56 v193.04,162.56 | v194.94,150.5 196.85,148.59 v203.2,148.59 | v205.11,126.36 205.74,125.73 LOGIC_SELECTOR-XOR/NOT_LOWER.12 210.82,124.46 237.49,124.46 238.76,125.73 LOGIC_SELECTOR-AND/OR_LOWER.12 241.3,125.73 v246.38,130.81
  Bottom 0.152: v193.04,162.56 193.04,152.4 v194.94,150.5 | v203.2,148.59 203.2,138.43 205.11,136.52 v205.11,126.36 | LOGIC_LED_4.A 248.92,165.1 248.28,165.1 248.28,160.65 246.38,158.75 v246.38,130.81
LOGIC_5  (via drill 0.35)
  Top 0.152: LOGIC_SELECTOR-XOR/NOT_UPPER.4 190.5,129.54 217.17,129.54 218.44,128.27 LOGIC_SELECTOR-AND/OR_UPPER.4 220.98,128.27 222.25,129.54 241.3,129.54 v243.21,131.44 | v179.07,161.29 OUTPUT_BUFFER_LOGIC.6 | v243.21,164.46 LOGIC_LED_5.A
  Bottom 0.152: v179.07,161.29 178.44,160.65 178.44,130.81 179.07,130.18 187.32,130.18 LOGIC_SELECTOR-XOR/NOT_UPPER.4 | v243.21,131.44 v243.21,164.46
LOGIC_6  (via drill 0.35)